# Altium project Power_meter.PrjPCB
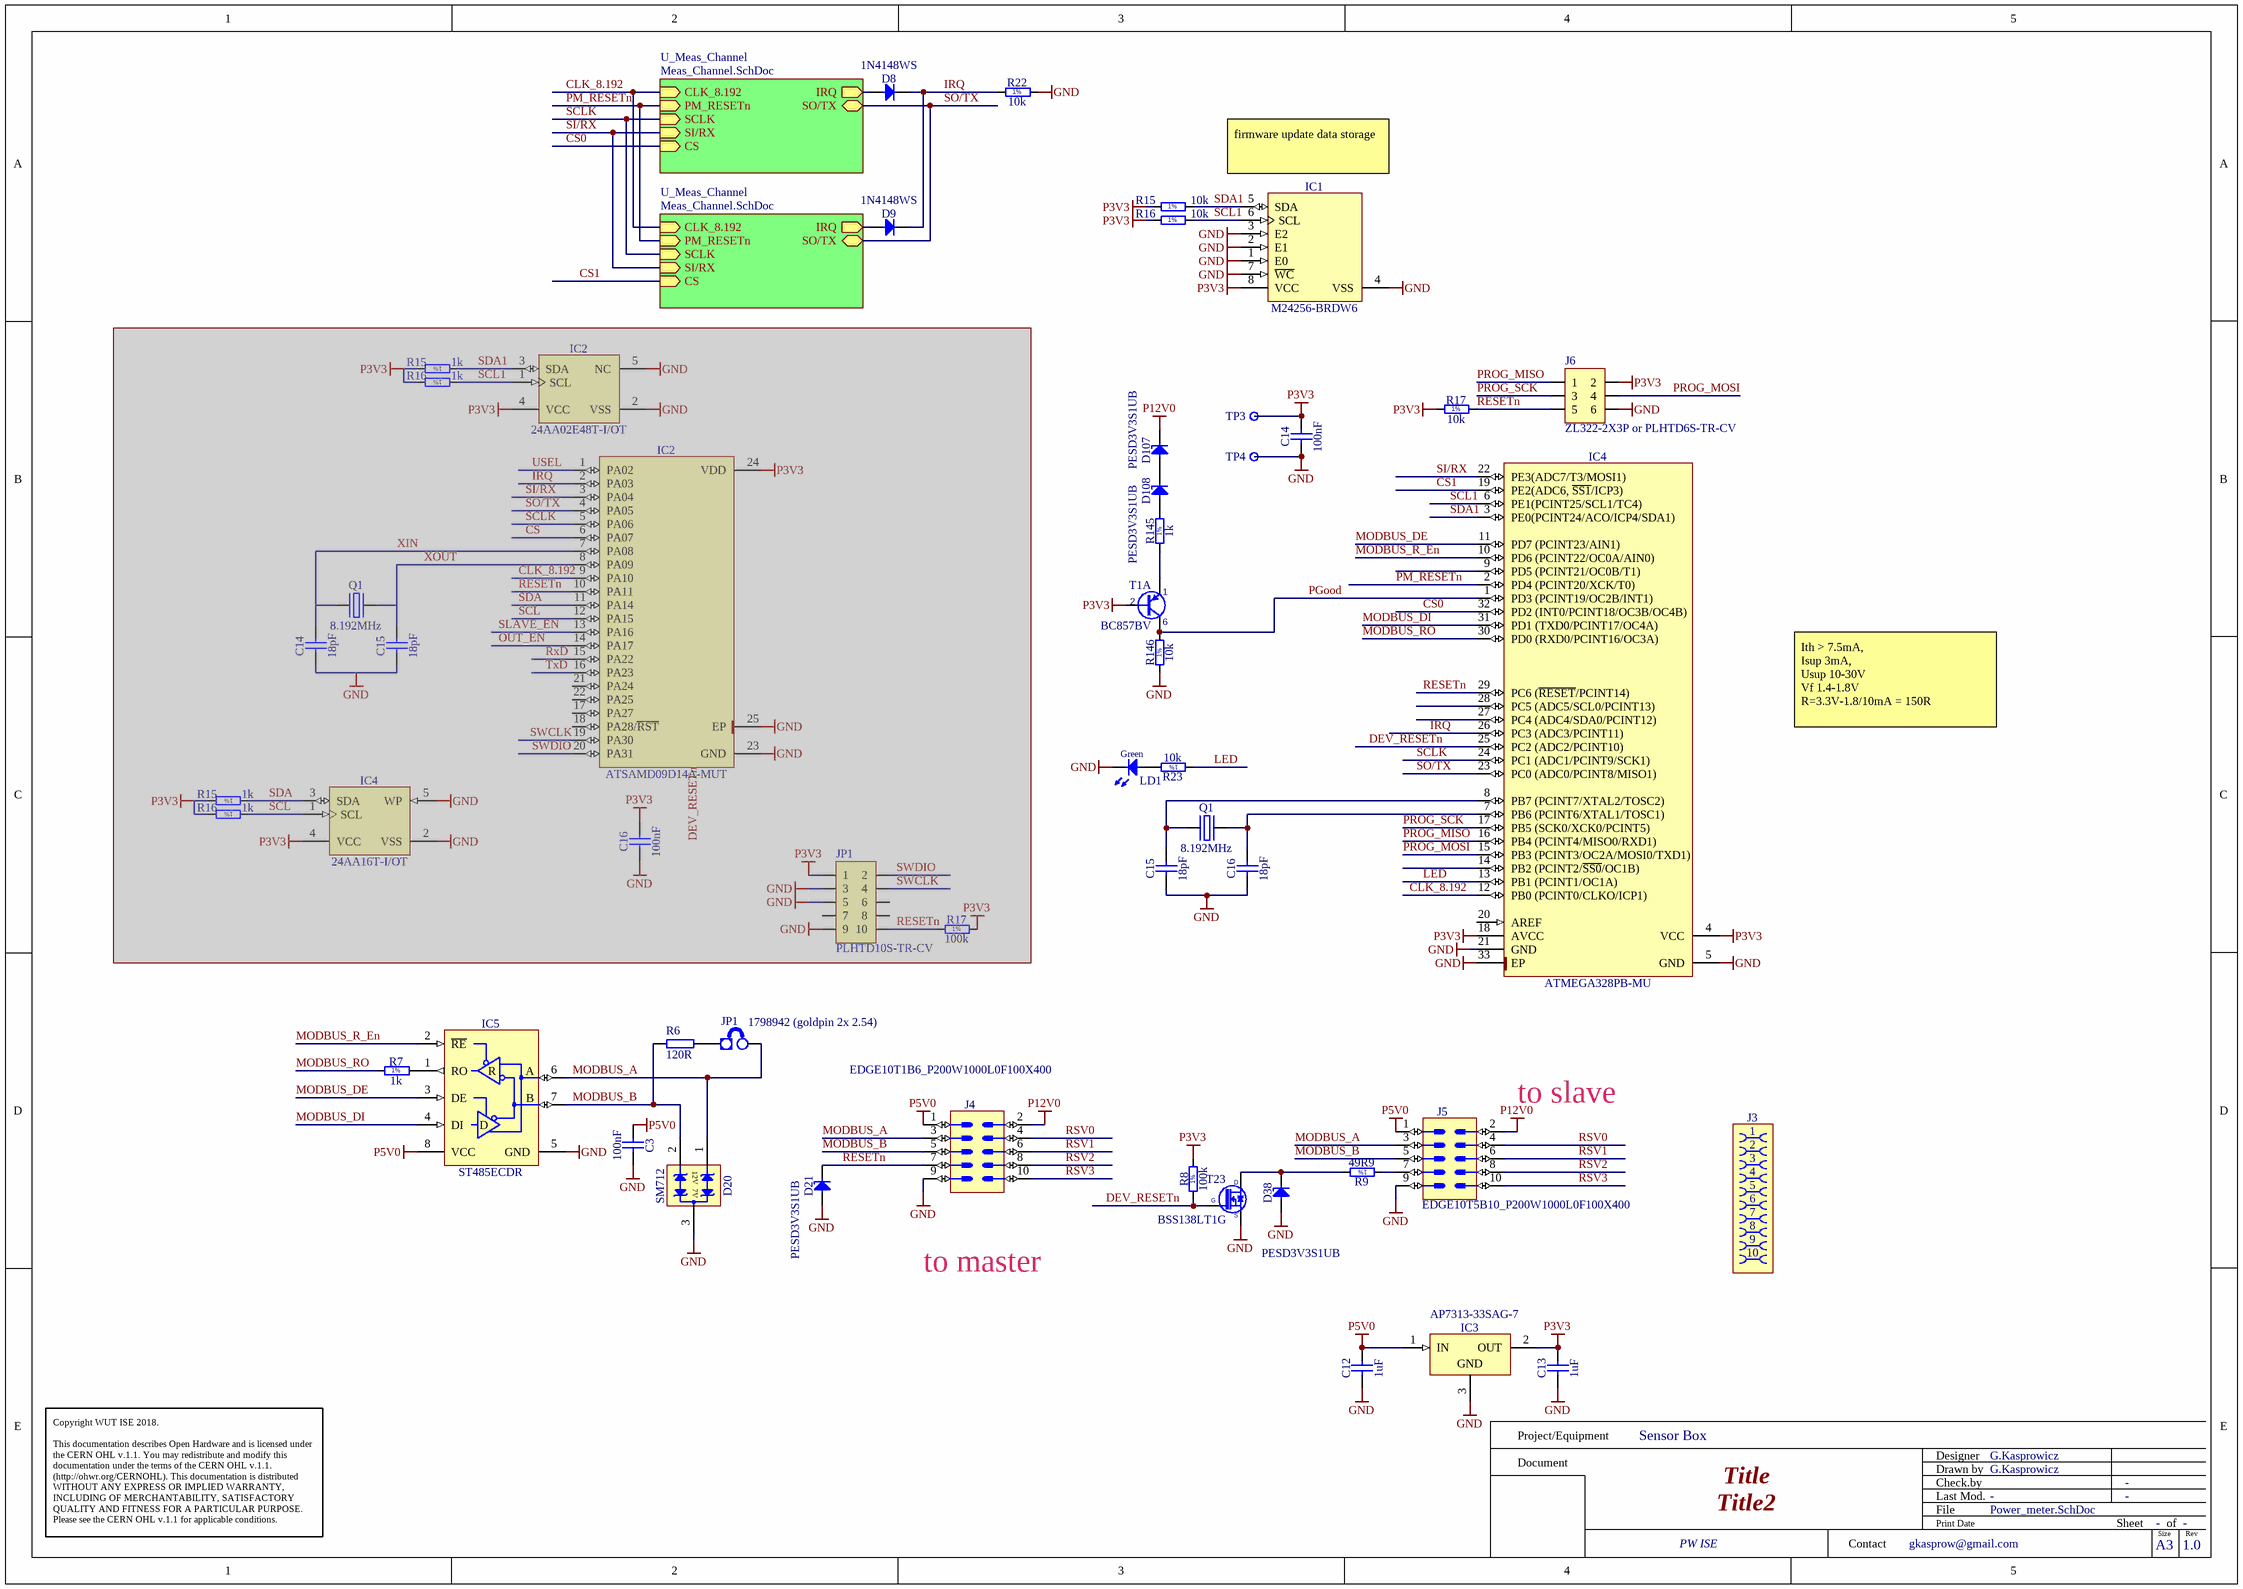
[diagram p0: Power_meter.SchDoc]
2 sheets, 114 parts. Net scope: hierarchical (ports join the sheet entries above them; power ports are global).
Board file: Power_meter.PCBDOC
Sheets:
  Power_meter.SchDoc
    U_Meas_Channel = Meas_Channel.SchDoc
    U_Meas_Channel = Meas_Channel.SchDoc

## Sheet Power_meter.SchDoc: Title
size 420 x 297 mm; Author: G.Kasprowicz; CompanyName: WUT ISE; DrawnBy: G.Kasprowicz; Organization: WUT ISE; Address1: PW ISE; Address2: Nowowiejska 15/19 00-665 Warsaw; Address3: gkasprow@gmail.com; Revision: 1.0; SheetNumber: -; SheetTotal: -; ModifiedBy: -; CheckedDate: -; Title2: Title2; DivGrp: WUT ISE; Designer: G.Kasprowicz; ModifiedDate: -; ProjectName: Sensor Box

### Parts
(Parts that share a designator on the sheet are numbered #1, #2 ... from top to bottom, then left to right.)
C3  100nF  [CAPC1005X55N]
C12  1uF  [CAPC1005X55N]
C13  1uF  [CAPC1005X55N]
C14#1  100nF  [CAPC1005X55N]
C14#2  18pF  [CAPC1005X55N]  (masked out: inside a compile mask, not in the netlist)
C15#1  18pF  [CAPC1005X55N]  (masked out: inside a compile mask, not in the netlist)
C15#2  18pF  [CAPC1005X55N]
C16#1  100nF  [CAPC1005X55N]  (masked out: inside a compile mask, not in the netlist)
C16#2  18pF  [CAPC1005X55N]
D8  1N4148WS  [SODFL2512X100N]
D9  1N4148WS  [SODFL2512X100N]
D20  SM712  [SOT95P237X112-3N]
D21  PESD3V3S1UB  [SODFL1608X65N]
D38  PESD3V3S1UB  [SODFL1608X65N]
D107  PESD3V3S1UB  [SODFL1608X65N]
D108  PESD3V3S1UB  [SODFL1608X65N]
IC1  M24256-BRDW6  [SOP65P640X120-8N]
IC2#1  24AA02E48T-I/OT  [SOT95P280X145-5N]  (masked out: inside a compile mask, not in the netlist)
IC2#2  ATSAMD09D14A-MUT  [QFN50P400X400X90-25N-S275]  (masked out: inside a compile mask, not in the netlist)
IC3  AP7313-33SAG-7  [SOT95P240X130-3N]
IC4#1  ATMEGA328PB-MU  [QFN50P500X500X100-33N-S325]
IC4#2  24AA16T-I/OT  [SOT95P280X145-5N]  (masked out: inside a compile mask, not in the netlist)
IC5  ST485ECDR  [SOIC127P600X175-8N]
J3  (no value)  [AVX_00 9159 010 061 916]
J4  (no value)  [EDGE10T1B6_P200W1000L0F100X400]
J5  (no value)  [EDGE10T5B10_P200W1000L0F100X400]
J6  ZL322-2X3P or PLHTD6S-TR-CV  [ZL322-2X3P]
JP1#1  PLHTD10S-TR-CV  [PLHTD10S-TR-CV]  (masked out: inside a compile mask, not in the netlist)
JP1#2  1798942 (goldpin 2x 2.54)  [jump]
LD1  Green  [LED_KINGBRIGHT_KPH-1608CGCK]
Q1#1  8.192MHz  [XTAL_ABRACON_ABLS]  (masked out: inside a compile mask, not in the netlist)
Q1#2  8.192MHz  [XTAL_ABRACON_ABLS]
R6  120R  [1206R]
R7  1k  [RESC1005X40N]
R8  100k  [RESC1005X40N]
R9  49R9  [RESC1005X40N]
R15#1  10k  [RESC1005X40N]
R15#2  1k  [RESC1005X40N]  (masked out: inside a compile mask, not in the netlist)
R15#3  1k  [RESC1005X40N]  (masked out: inside a compile mask, not in the netlist)
R16#1  10k  [RESC1005X40N]
R16#2  1k  [RESC1005X40N]  (masked out: inside a compile mask, not in the netlist)
R16#3  1k  [RESC1005X40N]  (masked out: inside a compile mask, not in the netlist)
R17#1  10k  [RESC1005X40N]
R17#2  100k  [RESC1005X40N]  (masked out: inside a compile mask, not in the netlist)
R22  10k  [RESC1005X40N]
R23  10k  [RESC1005X40N]
R145  1k  [RESC1005X40N]
R146  10k  [RESC1005X40N]
T1  BC857BV  [SOTFL50P160X60-6N]  (part A of 2)
T23  BSS138LT1G  [SOT95P240X110-3N]
TP3  Test Point  [TPS127]  (value not drawn)
TP4  Test Point  [TPS127]  (value not drawn)

### Sub-sheets
U_Meas_Channel = Meas_Channel.SchDoc: CLK_8.192 (in), IRQ (out), PM_RESETn (in), SCLK (in), SI/RX (in), CS (in), SO/TX (bidir)
U_Meas_Channel = Meas_Channel.SchDoc: CLK_8.192 (in), IRQ (out), PM_RESETn (in), SCLK (in), SI/RX (in), CS (in), SO/TX (bidir)

### Nets
GND: C3.2 C12.1 C13.1 C14#1.1 C15#2.1 C16#2.1 D20.3(GND) D21.2(A) D38.2(A) IC1.1(E0) IC1.2(E1) IC1.3(E2) IC1.4(VSS) IC1.7(~{WC}) IC3.3(GND) IC4#1.5(GND) IC4#1.21(GND) IC4#1.33(EP) IC5.5(GND) J4.9 J5.9 J6.6 LD1.1(C) R22.2 R146.1 T23.2(S) TP4.1
P3V3: C13.2 C14#1.2 IC1.8(VCC) IC3.2(OUT) IC4#1.4(VCC) IC4#1.18(AVCC) J6.2 R8.2 R15#1.1 R16#1.1 R17#1.1 T1.2(B) TP3.1
P5V0: C3.1 C12.2 IC3.1(IN) IC5.8(VCC) J4.1 J5.1
P12V0: D107.1(C) J4.2 J5.2
CLK_8.192: IC4#1.12(PB0_(PCINT0/CLKO/ICP1)) ; sheet U_Meas_Channel/CLK_8.192, sheet U_Meas_Channel/CLK_8.192
CS0: IC4#1.32(PD2_(INT0/PCINT18/OC3B/OC4B)) ; sheet U_Meas_Channel/CS
CS1: IC4#1.19(PE2(ADC6,_~{SS1}/ICP3)) ; sheet U_Meas_Channel/CS
DEV_RESETn: IC4#1.25(PC2_(ADC2/PCINT10)) R8.1 T23.1(G)
IRQ: D8.1(C) D9.1(C) IC4#1.26(PC3_(ADC3/PCINT11)) R22.1
LED: IC4#1.13(PB1_(PCINT1/OC1A)) R23.1
MODBUS_A: D20.1(I/O1) IC5.6(A) J4.3 J5.3 JP1#2.2(E2)
MODBUS_B: D20.2(I/O2) IC5.7(B) J4.5 J5.5 R6.1
MODBUS_DE: IC4#1.11(PD7_(PCINT23/AIN1)) IC5.3(DE)
MODBUS_DI: IC4#1.31(PD1_(TXD0/PCINT17/OC4A)) IC5.4(DI)
MODBUS_R_En: IC4#1.10(PD6_(PCINT22/OC0A/AIN0)) IC5.2(~{RE})
MODBUS_RO: IC4#1.30(PD0_(RXD0/PCINT16/OC3A)) R7.1
PGood: IC4#1.1(PD3_(PCINT19/OC2B/INT1)) R146.2 T1.6(C)
PM_RESETn: IC4#1.2(PD4_(PCINT20/XCK/T0)) ; sheet U_Meas_Channel/PM_RESETn, sheet U_Meas_Channel/PM_RESETn
PROG_MISO: IC4#1.16(PB4_(PCINT4/MISO0/RXD1)) J6.1
PROG_MOSI: IC4#1.15(PB3_(PCINT3/OC2A/MOSI0/TXD1)) J6.4
PROG_SCK: IC4#1.17(PB5_(SCK0/XCK0/PCINT5)) J6.3
RESETn: D21.1(C) IC4#1.29(PC6_(~{RESET}/PCINT14)) J4.7 J6.5 R17#1.2
RSV0: J4.4 J5.4
RSV1: J4.6 J5.6
RSV2: J4.8 J5.8
RSV3: J4.10 J5.10
SCL1: IC1.6(SCL) IC4#1.6(PE1(PCINT25/SCL1/TC4)) R16#1.2
SCLK: IC4#1.24(PC1_(ADC1/PCINT9/SCK1)) ; sheet U_Meas_Channel/SCLK, sheet U_Meas_Channel/SCLK
SDA1: IC1.5(SDA) IC4#1.3(PE0(PCINT24/ACO/ICP4/SDA1)) R15#1.2
SI/RX: IC4#1.22(PE3(ADC7/T3/MOSI1)) ; sheet U_Meas_Channel/SI/RX, sheet U_Meas_Channel/SI/RX
SO/TX: IC4#1.23(PC0_(ADC0/PCINT8/MISO1)) ; sheet U_Meas_Channel/SO/TX, sheet U_Meas_Channel/SO/TX
NetC15#2_2: C15#2.2 IC4#1.8(PB7_(PCINT7/XTAL2/TOSC2)) Q1#2.1(OSC1)
NetC16#2_2: C16#2.2 IC4#1.7(PB6_(PCINT6/XTAL1/TOSC1)) Q1#2.2(OSC2)
NetD8_2: D8.2(A) ; sheet U_Meas_Channel/IRQ
NetD9_2: D9.2(A) ; sheet U_Meas_Channel/IRQ
NetD38_1: D38.1(C) R9.2 T23.3(D)
NetD107_2: D107.2(A) D108.1(C)
NetD108_2: D108.2(A) R145.2
NetIC5_1: IC5.1(RO) R7.2
NetJ5_7: J5.7 R9.1
NetJP1#2_1: JP1#2.1(E1) R6.2
NetLD1_2: LD1.2(A) R23.2
NetR145_1: R145.1 T1.1(E)

Not connected (* = marked no-connect by the designer): IC4#1 9(PD5_(PCINT21/OC0B/T1)) 14(PB2_(PCINT2/~{SS0}/OC1B)) 20(AREF) 27(PC4_(ADC4/SDA0/PCINT12)) 28(PC5_(ADC5/SCL0/PCINT13))

### Notes on the sheet
- firmware update data storage
- Ith > 7.5mA,
  Isup 3mA,
  Usup 10-30V
  Vf 1.4-1.8V
  R=3.3V-1.8/10mA = 150R
- (near J5) to slave
- to master
- Project/Equipment
- Document
- Designer
- Drawn by
- Check.by
- Copyright WUT ISE 2018.
  This documentation describes Open Hardware and is licensed under the CERN OHL v.1.1. You may redistribute and modify this documentation under the terms of the CERN OHL v.1.1. (http://ohwr.org/CERNOHL). This documentation is distributed WITHOUT ANY EXPRESS OR IMPLIED WARRANTY, INCLUDING OF MERCHANTABILITY, SATISFACTORY QUALITY AND FITNESS FOR A PARTICULAR PURPOSE. Please see the CERN OHL v.1.1 for applicable conditions.
- Contact
- File
- Last Mod.
- Print Date
- Sheet
- Size
- A3
- of
- Rev
- (in symbol R0402_1K_1%_0.0625W_100PPM) 1%
- (in symbol R0402_10K_1%_0.0625W_100PPM) 1%
- (in symbol R0402_49R9_1%_0.0625W_100PPM) 1%
- (in symbol R0402_100K_1%_0.0625W_100PPM) 1%
- (in symbol SM712) 12V; 7V
- (in symbol ST485ECDR) R; D

### Library data of the parts
C3 = CC0402_100NF_16V_10%_X7R: Non-polarised capacitor; Part Description: SMD Multilayer Chip Ceramic Capacitor; Manufacturer: GENERIC; Manufacturer1 Part Number: GRM155R71C104KA88D; Voltage: 16V; TC: X7R; Tolerance: ±10%; Part Number: CC0402_100NF_16V_10%_X7R; Component Kind: Standard; Component Type: Standard; Pin Count: 2; Value: 100nF; Status: Not Recommended; Manufacturer Part Number: CC0402_100NF_16V_10%_X7R; Case: 0402; Mounted: Yes; Socket: No; SMD: Yes; Manufacturer1 Example: MURATA; Manufacturer1 ComponentHeight: 0.55mm; HelpURL: \\cern.ch\dfs\Applications\Altium\Datasheets\CC0402_X7R_MURATA_GRM.pdf; Author: CERN DEM JLC; CreateDate: 05.12.2013; LatestRevisionDate: 03.12.2007; Sense: No
C12 C13 = CC0402_1UF_16V_10%_X5R: Non-polarised capacitor; Part Description: SMD Multilayer Chip Ceramic Capacitor; Manufacturer: GENERIC; Manufacturer1 Part Number: C1005X5R1C105KT; Voltage: 16V; TC: X5R; Tolerance: ±10%; Part Number: CC0402_1UF_16V_10%_X5R; Component Kind: Standard; Component Type: Standard; Pin Count: 2; Value: 1uF; Status: Preferred; Manufacturer Part Number: CC0402_1UF_16V_10%_X5R; Case: 0402; Mounted: Yes; Socket: No; SMD: Yes; Sense: No; Manufacturer1 Example: TDK; Manufacturer1 ComponentHeight: 0.55mm; HelpURL: \\cern.ch\dfs\Applications\Altium\Datasheets\CC0402_X5R_TDK_C.pdf; Author: CERN DEM JLC; CreateDate: 25.10.2012; LatestRevisionDate: 25.10.2012
C14#1 C16#1 = CC0402_100NF_16V_10%_X5R: Non-polarised capacitor; Part Description: SMD Multilayer Chip Ceramic Capacitor; Manufacturer: GENERIC; Manufacturer1 Part Number: GRM155R61C104KA88D; Voltage: 16V; TC: X5R; Tolerance: ±10%; Part Number: CC0402_100NF_16V_10%_X5R; Component Kind: Standard; Component Type: Standard; Pin Count: 2; Value: 100nF; Status: None; Manufacturer Part Number: CC0402_100NF_16V_10%_X5R; Case: 0402; Mounted: Yes; Socket: No; SMD: Yes; Sense: No; Manufacturer1 Example: MURATA; Manufacturer1 ComponentHeight: 0.55mm; HelpURL: \\cern.ch\dfs\Applications\Altium\Datasheets\CC0402_X5R_MURATA_GRM.pdf; Author: CERN DEM JLC; CreateDate: 10.12.2013; LatestRevisionDate: 10.12.2013
C14#2 C15#1 C15#2 C16#2 = CC0402_18PF_50V_5%_C0G: Non-polarised capacitor; Part Description: SMD Multilayer Chip Ceramic Capacitor; Manufacturer: GENERIC; Manufacturer1 Part Number: C0402C180J5GACTU; Voltage: 50V; TC: C0G/NP0; Tolerance: ±5%; Part Number: CC0402_18PF_50V_5%_C0G; Component Kind: Standard; Component Type: Standard; Pin Count: 2; Value: 18pF; Status: Preferred; Manufacturer Part Number: CC0402_18PF_50V_5%_C0G; Case: 0402; Mounted: Yes; Socket: No; SMD: Yes; Sense: No; Manufacturer1 Example: KEMET; Manufacturer1 ComponentHeight: 0.55mm; HelpURL: \\cern.ch\dfs\Applications\Altium\Datasheets\CC0805_C0G_KEMET_(Commercial Grade).pdf; Author: CERN DEM JLC; CreateDate: 04.10.2016; LatestRevisionDate: 04.10.2016
D8 D9 = 1N4148WS: Diode; Part Description: Small Signal Diodes; Manufacturer: FAIRCHILD SEMICONDUCTOR; Voltage: 75V; Power: 150mA; PressFit: No; Bonding: No; Part Number: 1N4148WS; Component Kind: Standard; Component Type: Standard; Device: 1N4148WS; PackageDescription: SODFL Diode; 1.70mm W X 1.25mm L X 1.00mm H body, IPC Medium Density; Manufacturer Part Number: 1N4148WS; Pin Count: 2; Case: SOD-323F; Mounted: Yes; Socket: No; SMD: Yes; Sense: No; ComponentHeight: 1mm; HelpURL: \\cern.ch\dfs\Applications\Altium\Datasheets\1N4148WS.pdf; Author: CERN DEM JLC; CreateDate: 12.05.2011; LatestRevisionDate: 12.05.2011
D20 = SM712: Asymmetrical TVS Diode for Extended Common-Mode RS-485; Manufacturer: SEMTECH; Voltage: 12V/-7V; Power: 400W; PressFit: No; Bonding: No; Part Number: SM712; Component Kind: Standard; Component Type: Standard; Device: SM712; PackageDescription: SOT, 0.95mm, pitch; 3 pin,1.30mm W X 2.92mm L X 1.12mm H body, IPC Medium Density; Status: Obsolete; Part Description: Asymmetrical TVS Diode for Extended Common-Mode RS-485; Manufacturer Part Number: SM712; Pin Count: 3; Case: SOT-23; Mounted: Yes; Socket: No; SMD: Yes; Sense: No; ComponentHeight: 1.12mm; HelpURL: \\cern.ch\dfs\Applications\Altium\Datasheets\SM712.pdf; Author: CERN DEM JLC; CreateDate: 23.04.2012; LatestRevisionDate: 23.04.2012
D21 D38 D107 D108 = PESD3V3S1UB: ESD protection diode; Part Description: ESD protection diode (23kV); Manufacturer: NXP SEMICONDUCTORS; Voltage: 3V3; Power: 330W; PressFit: No; Bonding: No; Part Number: PESD3V3S1UB; Component Kind: Standard; Component Type: Standard; Device: PESD3V3S1UB; PackageDescription: Ultra Small Outline Diode Flat Lead (SOD-523), Body; 1.2mm L X 0.8mm W X 0.65mm H, IPC Medium Density; Manufacturer Part Number: PESD3V3S1UB; Pin Count: 2; Case: SOD523; Mounted: Yes; Socket: No; SMD: Yes; Sense: No; ComponentHeight: 0.65mm; HelpURL: \\cern.ch\dfs\Applications\Altium\Datasheets\PESD3V3S1UB.pdf; Author: CERN DEM JLC; CreateDate: 29.11.2012; LatestRevisionDate: 29.11.2012
IC1 = MEM_M24256-BRDW6P: 256-Kbit Serial I²C Bus EEPROM; Manufacturer: ST MICROELECTRONICS; PressFit: No; Bonding: No; Part Number: M24256-BRDW6P; Component Kind: Standard; Component Type: Standard; Device: M24256-BRDW6; PackageDescription: SOP, 0.65mm pitch; 8 pin, 4.40mm W X 3.00mm L X 1.20mm H body, IPC Medium Density; Part Description: 256-Kbit Serial I²C Bus EEPROM; Manufacturer Part Number: M24256-BRDW6; Pin Count: 8; Case: TSSOP8; Mounted: Yes; Socket: No; SMD: Yes; Sense: No; ComponentHeight: 1.2mm; HelpURL: \\cern.ch\dfs\Applications\Altium\Datasheets\M24256-BRDW6P.pdf; Author: CERN DEM MR; CreateDate: 17.03.2016; LatestRevisionDate: 17.03.2016
IC2#1 = 24AA02E48T-I/OT: 1.7V-5.5V, 2K I2C Serial EEPROM With EUI-48 Node Identity; Manufacturer: MICROCHIP TECHNOLOGY; PressFit: No; Bonding: No; Part Number: 24AA02E48T-I/OT; Component Kind: Standard; Component Type: Standard; Device: 24AA02E48T-I/OT; PackageDescription: SOT, 0.95mm pitch; 5 pin, 1.60mm W X 2.90mm L X 1.45mm H body, IPC Medium Density; Part Description: 1.7V-5.5V, 2K I2C Serial EEPROM With EUI-48 Node Identity; Manufacturer Part Number: 24AA02E48T-I/OT; Pin Count: 5; Case: SOT23-5; Mounted: Yes; Socket: No; SMD: Yes; Sense: No; ComponentHeight: 1.45mm; HelpURL: \\cern.ch\dfs\Applications\Altium\Datasheets\24AA02E48T-I-OT.pdf; Author: CERN DEM MR; CreateDate: 31.03.2016; LatestRevisionDate: 31.03.2016
IC2#2 = ATSAMD09D14A-MUT: 32-bit ARM®-based Cortex®-M0+ core Microcontroller, 2.4V to 3.63V, 48MHz, 16KB Flash, 4 KB SRAM, 24 QFN, Temperature Range -40°C to 85°C; Manufacturer: MICROCHIP; PressFit: No; Bonding: No; Part Number: ATSAMD09D14A-MUT; Component Kind: Standard; Component Type: Standard; Device: ATSAMD09D14A-MUT; PackageDescription: QFN, 0.50mm Pitch, Square; 24 Pin, 4.00mm L X 4.00mm W X 0.90mm H Body (w/Thermal Tab 2.75 X 2.75 mm), IPC Medium Density; Part Description: 32-bit ARM®-based Cortex®-M0+ core Microcontroller, 2.4V to 3.63V, 48MHz, 16KB Flash, 4 KB SRAM, 24 QFN, Temperature Range -40°C to 85°C; Manufacturer Part Number: ATSAMD09D14A-MUT; Pin Count: 25; Case: QFN24; Mounted: Yes; Socket: No; SMD: Yes; Sense: No; ComponentHeight: 0.9mm; HelpURL: \\cern.ch\dfs\Applications\Altium\Datasheets\ATSAMD09D14A-MUT.pdf; Author: CERN DEM MR; CreateDate: 13.02.2018; LatestRevisionDate: 13.02.2018
IC3 = AP7313-33SAG-7: 3-Terminal Regulator 1=IN 2=OUT 3=GND; Part Description: 3.3V, 150mA Low Quiescent Current, Fast Transient Low Dropout Linear Regulator; Manufacturer: DIODES INCORPORATED; PressFit: No; Bonding: No; Part Number: AP7313-33SAG-7; Component Kind: Standard; Component Type: Standard; Device: AP7313-33SAG-7; PackageDescription: SOT23 3-Leads, Pitch 0.95mm - Body 1.3x2.9mm, IPC Medium Density; Manufacturer Part Number: AP7313-33SAG-7; Pin Count: 3; Case: SOT23; Mounted: Yes; Socket: No; SMD: Yes; Sense: No; ComponentHeight: 1.35mm; HelpURL: \\cern.ch\dfs\Applications\Altium\Datasheets\AP7313-33SAG-7.pdf; Author: CERN DEM JLC; CreateDate: 20.03.2018; LatestRevisionDate: 20.03.2018
IC4#1 = UPC_ATMEGA328PB-MU: 8-bit AVR 20MHz Microcontroller With 32K Bytes In-System  Programmable  Flash; Part Description: 8-bit AVR Microcontroller, 32KB Flash, 1KB EEPROM, 2KB SRAM, 32-pin MLF, Industrial Grade (-40°C to 85°C); Manufacturer: ATMEL; PressFit: No; Bonding: No; Part Number: ATMEGA328PB-MU; Component Kind: Standard; Component Type: Standard; Device: ATMEGA328PB-MU; PackageDescription: QFN, (MO-220-VHHD-2) 0.50mm pitch,square; 8 pin X 8 pin, 5mm X 5mm X 1.00mm H body (w/thermal tab 3.25 X 3.25mm),  IPC Medium Density; Manufacturer Part Number: ATMEGA328PB-MU; Pin Count: 33; Case: QFN32; Mounted: Yes; Socket: No; SMD: Yes; Sense: No; ComponentHeight: 1mm; HelpURL: \\cern.ch\dfs\Applications\Altium\Datasheets\ATMEGA328P-MU.pdf; Author: GK; CreateDate: 2011-02-08; LatestRevisionDate: 2014-07-02
IC4#2 = MEM_24AA16T_SOT23: 1.7V-5.5V, 2K I2C Serial EEPROM With EUI-48 Node Identity; Part Description: 1.7V-5.5V, 16K I2C Serial EEPROM; Manufacturer: MICROCHIP TECHNOLOGY; PressFit: No; Bonding: No; Part Number: 24AA16T-I/OT; Component Kind: Standard; Component Type: Standard; Device: 24AA16T-I/OT; PackageDescription: SOT, 0.95mm pitch; 5 pin, 1.60mm W X 2.90mm L X 1.45mm H body, IPC Medium Density; Manufacturer Part Number: 24AA16T-I/OT; Pin Count: 5; Case: SOT23-5; Mounted: Yes; Socket: No; SMD: Yes; Sense: No; ComponentHeight: 1.45mm; HelpURL: \\cern.ch\dfs\Applications\Altium\Datasheets\24AA02E48T-I-OT.pdf; Author: GK; CreateDate: 31.03.2016; LatestRevisionDate: 31.03.2016
IC5 = ST485ECDR: ±15kV ESD-Protected, Low Power  RS-485/RS-422 Transceiver; Manufacturer: ST MICROELECTRONICS; PressFit: No; Bonding: No; Part Number: ST485ECDR; Component Kind: Standard; Component Type: Standard; Device: ST485ECDR; PackageDescription: SOIC 8, Pitch 1.27mm - Body 4x5mm, IPC Medium Density; Part Description: ±15kV ESD-Protected, Low Power  RS-485/RS-422 Transceiver; Manufacturer Part Number: ST485ECDR; Pin Count: 8; Case: SOIC8; Mounted: Yes; Socket: No; SMD: Yes; Sense: No; ComponentHeight: 1.75mm; Author: CERN DEM MR; HelpURL: \\cern.ch\dfs\Applications\Altium\Datasheets\ST485ECDR.pdf; CreateDate: 15.02.2018; LatestRevisionDate: 15.02.2018
J3 = AVX_00 9159 010 061 916: Open Ended Card Edge Connector, 9159 Series; Part Description: 10 Contacts, 2mm Pitch, Open Ended Card Edge Connector, 9159 Series; Manufacturer: AVX; PressFit: No; Part Number: AVX_00 9159 010 061 916; Component Kind: Standard; Component Type: Standard; Pin Count: 10; Mounted: Yes; Socket: No; SMD: No; Sense: No; Status: None; Manufacturer Part Number: 00 9159 010 061 916; ComponentHeight: 1.6mm; HelpURL: \\cern.ch\dfs\Applications\Altium\Datasheets\AVX_00 9159 010 061 916.pdf; Author: CERN DEM MR; CreateDate: 13.02.2018; LatestRevisionDate: 13.02.2018
J4 = EDGE10T1B6_P200W1000L0F100X400: PCB Edge Connector 10 (2x5); Part Description: 10 Contacts Board Edge Connector, Pitch 2mm, Length 0mm, Width 10mm, Finger Lenght 4mm, Finger Width 1mm; Mounted: No; PressFit: No; Part Number: EDGE10T1B6_P200W1000L0F100X400; Component Kind: Standard (No BOM); Component Type: Standard (No BOM); Pin Count: 10; Socket: No; SMD: No; Sense: No; Status: None; ComponentHeight: 0mm; HelpURL: \\cern.ch\dfs\Applications\Altium\Datasheets\EDGE10T1B6_P200W1000L0F100X400.pdf; Author: CERN DEM MR; CreateDate: 14.02.2018; LatestRevisionDate: 14.02.2018
J5 = EDGE10T5B10_P200W1000L0F100X400: PCB Edge Connector 10 (2x5); Part Description: 10 Contacts Board Edge Connector, Pitch 2mm, Length 0mm, Width 10mm, Finger Lenght 4mm, Finger Width 1mm; Mounted: No; PressFit: No; Part Number: EDGE10T5B10_P200W1000L0F100X400; Component Kind: Standard (No BOM); Component Type: Standard (No BOM); Pin Count: 10; Socket: No; SMD: No; Sense: No; Status: None; ComponentHeight: 0mm; HelpURL: \\cern.ch\dfs\Applications\Altium\Datasheets\EDGE10T5B10_P200W1000L0F100X400.pdf; Author: CERN DEM MR; CreateDate: 14.02.2018; LatestRevisionDate: 14.02.2018
J6 = CON_2x3 1.27 SMT Male: 1.27 mm dual row goldpin (Maritex)
JP1#1 = CON_2x5 1.27 SMT Male: 1.27 mm dual row goldpin (Maritex)
JP1#2 = JUMPER: Supplier 1: Farnell; Supplier Part Number 1: 1798942
LD1 = LED_KINGBRIGHT_KPH-1608CGCK: LED Green 1C 2A; Part Description: SMD Green LED, Case 1.6mmX0.8mm(0603), 0.65mm Thickness; PressFit: No; Bonding: No; Part Number: LED_KINGBRIGHT_KPH-1608CGCK; Component Kind: Standard; Component Type: Standard; Color: Green; PackageDescription: SMT Green LED, Case 0603, Body L 1.6 x W 0.8mm H 0.65mm; Manufacturer: KINGBRIGHT; Manufacturer Part Number: KPH-1608CGCK; Pin Count: 2; Mounted: Yes; Socket: No; SMD: Yes; Sense: No; ComponentHeight: 0.65mm; HelpURL: \\cern.ch\dfs\Applications\Altium\Datasheets\LED_KINGBRIGHT_KPH-1608CGCK.pdf; Author: CERN DEM JLC; CreateDate: 03.07.2017; LatestRevisionDate: 03.07.2017
Q1#1 Q1#2 = XTAL_8.192MHZ_ABRACON_ABLS-8.192MHZ-B2-T: Quartz Crystal; Part Description: Tolerance: ± 20ppm, Stability: ± 50ppm, -20°C to +70°C, 18pF, 80 Ohms ESR, Low Profile Surface Mount Microprocessor Crystal, ABLS Series; PressFit: No; Bonding: No; Part Number: XTAL_8.192MHZ_ABRACON_ABLS-8.192MHZ-B2-T; Component Kind: Standard; Component Type: Standard; PackageDescription: SMD Crystal, Body 11.40mm L X 4.70mm W X 4.20mm H, HC/49US (AT49) ALBS Series; Value: 8.192MHz; Manufacturer: ABRACON; Manufacturer Part Number: ABLS-8.192MHZ-B2-T; Pin Count: 2; Mounted: Yes; Socket: No; SMD: Yes; Sense: No; ComponentHeight: 4.2mm; HelpURL: \\cern.ch\dfs\Applications\Altium\Datasheets\XTAL_ABRACON_ABLS.pdf; Author: CERN DEM MR; CreateDate: 15.02.2018; LatestRevisionDate: 15.02.2018
R6 = RES_1206: SMD Resistor; Supplier 1: Newark; Supplier Part Number 1: 39K0871
R7 R15#2 R15#3 R16#2 R16#3 R145 = R0402_1K_1%_0.0625W_100PPM: Resistor - 1%; Part Description: General Purpose Thick Film Chip Resistor; Manufacturer: GENERIC; Manufacturer1 Part Number: 232270671002L; TC: ±100ppm/°C; PressFit: No; Part Number: R0402_1K_1%_0.0625W_100PPM; Component Kind: Standard; Component Type: Standard; Pin Count: 2; Value: 1k; Status: Not Recommended; Power: 0.0625W; Tolerance: ±1%; Manufacturer Part Number: R0402_1K_1%_0.0625W_100PPM; Case: 0402; Mounted: Yes; Sense: No; Socket: No; SMD: Yes; Manufacturer1 Example: YAGEO PHYCOMP; Manufacturer1 ComponentHeight: 0.4mm; HelpURL: \\cern.ch\dfs\Applications\Altium\Datasheets\R0402_Phycomp_RC0402.pdf; Author: CERN DEM JLC; CreateDate: 03.12.2007; LatestRevisionDate: 17.10.2012
R8 R17#2 = R0402_100K_1%_0.0625W_100PPM: Resistor - 1%; Part Description: General Purpose Thick Film Chip Resistor; Manufacturer: GENERIC; Manufacturer1 Part Number: 232270671004L; TC: ±100ppm/°C; PressFit: No; Part Number: R0402_100K_1%_0.0625W_100PPM; Component Kind: Standard; Component Type: Standard; Pin Count: 2; Value: 100k; Status: Not Recommended; Power: 0.0625W; Tolerance: ±1%; Manufacturer Part Number: R0402_100K_1%_0.0625W_100PPM; Case: 0402; Mounted: Yes; Sense: No; Socket: No; SMD: Yes; Manufacturer1 Example: YAGEO PHYCOMP; Manufacturer1 ComponentHeight: 0.4mm; HelpURL: \\cern.ch\dfs\Applications\Altium\Datasheets\R0402_Phycomp_RC0402.pdf; Author: CERN DEM JLC; CreateDate: 03.12.2007; LatestRevisionDate: 17.10.2012
R9 = R0402_49R9_1%_0.0625W_100PPM: Resistor - 1%; Part Description: General Purpose Thick Film Chip Resistor; Manufacturer: GENERIC; Manufacturer1 Part Number: 232270674999L or RC0402FR-0749R9L; TC: ±100ppm/°C; Table: Resistors SMD; Part Number: R0402_49R9_1%_0.0625W_100PPM; Component Kind: Standard; Component Type: Standard; Pin Count: 2; Value: 49R9; Status: Not recommended; Power: 0.0625W; Tolerance: ±1%; Manufacturer Part Number: R0402_49R9_1%_0.0625W_100PPM; Case: 0402; Mounted: Yes; Socket: No; SMD: Yes; Manufacturer1 Example: YAGEO PHYCOMP; Manufacturer1 ComponentHeight: 0.4mm; HelpURL: \\cern.ch\dfs\Applications\Altium\Datasheets\R0402_Phycomp_RC0402.pdf; Author: CERN DEM JLC; CreateDate: 2012-10-24; LatestRevisionDate: 2012-10-24
R15#1 R16#1 R17#1 R22 R23 R146 = R0402_10K_1%_0.0625W_100PPM: Resistor - 1%; Part Description: General Purpose Thick Film Chip Resistor; Manufacturer: GENERIC; Manufacturer1 Part Number: 232270671003L; TC: ±100ppm/°C; PressFit: No; Part Number: R0402_10K_1%_0.0625W_100PPM; Component Kind: Standard; Component Type: Standard; Pin Count: 2; Value: 10k; Status: Not Recommended; Power: 0.0625W; Tolerance: ±1%; Manufacturer Part Number: R0402_10K_1%_0.0625W_100PPM; Case: 0402; Mounted: Yes; Sense: No; Socket: No; SMD: Yes; Manufacturer1 Example: YAGEO PHYCOMP; Manufacturer1 ComponentHeight: 0.4mm; HelpURL: \\cern.ch\dfs\Applications\Altium\Datasheets\R0402_Phycomp_RC0402.pdf; Author: CERN DEM JLC; CreateDate: 03.12.2007; LatestRevisionDate: 17.10.2012
T1 = BC857BV: 45V, 100mA PNP General Purpose Double Transistor; Part Description: -45V -100mA PNP General Purpose Double Transistor; Manufacturer: NXP SEMICONDUCTORS; PressFit: No; Bonding: No; Part Number: BC857BV; Component Kind: Standard; Component Type: Standard; Device: BC857BV; PackageDescription: SOTFL (SOT666), 0.50mm, Pitch; 6 Pin, 1.20mm W X 1.60mm L X 0.60mm H Body, IPC Medium Density; Manufacturer Part Number: BC857BV; Pin Count: 6; Case: SOT666; Mounted: Yes; Socket: No; SMD: Yes; Sense: No; ComponentHeight: 0.6mm; HelpURL: \\cern.ch\dfs\Applications\Altium\Datasheets\BC857BV.pdf; Author: CERN DEM JLC; CreateDate: 01.12.2011; LatestRevisionDate: 01.12.2011
T23 = BSS138LT1G: N-CHANNEL MOSFET WITH DIODE; Part Description: 50V 200mA N-Channel Enhancement Mode Field-Effect Transistor; Manufacturer: ON SEMICONDUCTOR; PressFit: No; Bonding: No; Part Number: BSS138LT1G; Component Kind: Standard; Component Type: Standard; Device: BSS138LT1G; PackageDescription: SOT23 3-Leads, Pitch 0.95mm - Body 1.4x3mm, IPC Medium Density; Manufacturer Part Number: BSS138LT1G; Pin Count: 3; Case: SOT23-3; Mounted: Yes; Socket: No; SMD: Yes; Sense: No; ComponentHeight: 1.11mm; HelpURL: \\cern.ch\dfs\Applications\Altium\Datasheets\BSS138LT1G.pdf; Author: CERN DEM JLC; CreateDate: 23.03.2009; LatestRevisionDate: 23.03.2009
TP3 TP4 = SMD_PAD_1.27X1.27MM: Part Description: 1.27mm x 1.27mm PCB Copper Area (SMD Test Point); Mounted: No; Part Number: SMD_PAD_1.27X1.27MM; Component Kind: Standard (No BOM); Component Type: Standard (No BOM); Pin Count: 1; Family: Test Point; Socket: No; SMD: Yes; Sense: No; Status: None; ComponentHeight: 0mm; HelpURL: Undefined; Author: CERN DEM JLC; CreateDate: 12.01.2008; LatestRevisionDate: 12.01.2008; PackageDescription: 1.27mm x 1.27mm PCB Copper Area (SMD Test Point)

## Sheet Meas_Channel.SchDoc: Title
size 420 x 297 mm; Author: G.Kasprowicz; CompanyName: WUT ISE; DrawnBy: G.Kasprowicz; Organization: WUT ISE; Address1: PW ISE; Address2: Nowowiejska 15/19 00-665 Warsaw; Address3: gkasprow@gmail.com; Revision: 1.0; SheetNumber: -; SheetTotal: -; ModifiedBy: -; CheckedDate: -; Title2: Title2; DivGrp: WUT ISE; Designer: G.Kasprowicz; ModifiedDate: -; ProjectName: Sensor Box
Used 2 times, as channels U_Meas_Channel, U_Meas_Channel. Parts and nets are listed once, with the designators drawn on the sheet.
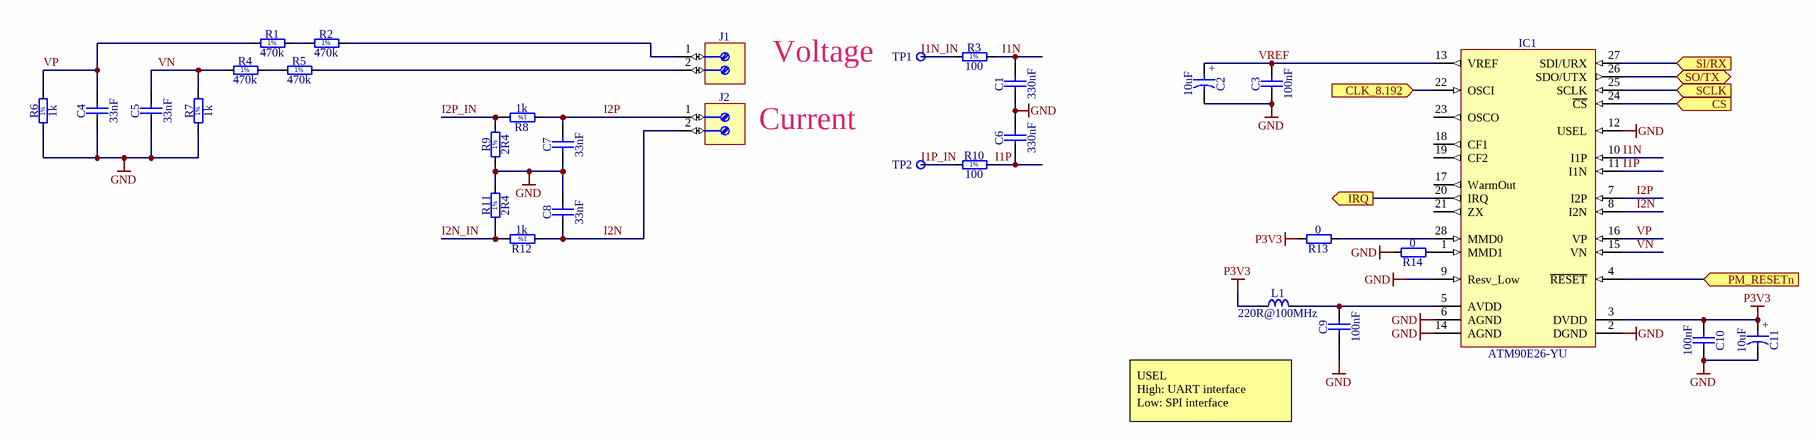
[diagram p1: Meas_Channel.SchDoc]

### Parts
C1  330nF  [CAPC1608X87N]
C2  10uF  [CAPMP3216X180N]
C3  100nF  [CAPC1005X55N]
C4  33nF  [CAPC1005X55N]
C5  33nF  [CAPC1005X55N]
C6  330nF  [CAPC1608X87N]
C7  33nF  [CAPC1005X55N]
C8  33nF  [CAPC1005X55N]
C9  100nF  [CAPC1005X55N]
C10  100nF  [CAPC1005X55N]
C11  10uF  [CAPMP3216X180N]
IC1  ATM90E26-YU  [SOP65P780X200-28N]
J1  (no value)  [PHOENIX_1751248]
J2  (no value)  [PHOENIX_1725656]
L1  220R@100MHz  [INDC1005X55N]
R1  470k  [RESC3216X65N]
R2  470k  [RESC3216X65N]
R3  100  [RESC1005X40N]
R4  470k  [RESC3216X65N]
R5  470k  [RESC3216X65N]
R6  1k  [RESC1005X40N]
R7  1k  [RESC1005X40N]
R8  1k  [RESC1005X40N]
R9  2R4  [RESC1608X55N]
R10  100  [RESC1005X40N]
R11  2R4  [RESC1608X55N]
R12  1k  [RESC1005X40N]
R13  0  [RESC1005X40N]
R14  0  [RESC1005X40N]
TP1  Test Point  [TPS127]  (value not drawn)
TP2  Test Point  [TPS127]  (value not drawn)

### Ports
CLK_8.192 (in), CS (in), IRQ (out), PM_RESETn (in), SCLK (in), SI/RX (in), SO/TX (bidir)

### Nets
GND: C1.1 C2.2 C3.1 C4.1 C5.1 C6.2 C7.1 C8.2 C9.1 C10.2 C11.2 IC1.2(DGND) IC1.6(AGND) IC1.9(Resv_Low) IC1.12(USEL) IC1.14(AGND) R6.1 R7.1 R9.1 R11.2 R14.2
P3V3: C10.1 C11.1 IC1.3(DVDD) L1.1 R13.2
CLK_8.192: IC1.22(OSCI) ; port CLK_8.192
CS: IC1.24(~{CS}) ; port CS
I1N: C1.2 IC1.10(I1P) R3.2
I1N_IN: R3.1 TP1.1
I1P: C6.1 IC1.11(I1N) R10.2
I1P_IN: R10.1 TP2.1
I2N: C8.1 IC1.8(I2N) J2.2 R12.1
I2N_IN: R11.1 R12.2
I2P: C7.2 IC1.7(I2P) J2.1 R8.1
I2P_IN: R8.2 R9.2
IRQ: IC1.20(IRQ) ; port IRQ
PM_RESETn: IC1.4(~{RESET}) ; port PM_RESETn
SCLK: IC1.25(SCLK) ; port SCLK
SI/RX: IC1.27(SDI/URX) ; port SI/RX
SO/TX: IC1.26(SDO/UTX) ; port SO/TX
VN: C5.2 IC1.15(VN) R4.1 R7.2
VP: C4.2 IC1.16(VP) R1.1 R6.2
VREF: C2.1 C3.2 IC1.13(VREF)
NetC9_2: C9.2 IC1.5(AVDD) L1.2
NetIC1_1: IC1.1(MMD1) R14.1
NetIC1_28: IC1.28(MMD0) R13.1
NetJ1_1: J1.1 R2.2
NetJ1_2: J1.2 R5.2
NetR1_2: R1.2 R2.1
NetR4_2: R4.2 R5.1

Not connected (* = marked no-connect by the designer): IC1 17(WarmOut) 18(CF1) 19(CF2) 21(ZX) 23(OSCO)

### Channels
U_Meas_Channel: designators end in B; ports CLK_8.192=CLK_8.192 CS=CS0 IRQ=NetD8_2 PM_RESETn=PM_RESETn SCLK=SCLK SI/RX=SI/RX SO/TX=SO/TX
U_Meas_Channel: designators end in A; ports CLK_8.192=CLK_8.192 CS=CS1 IRQ=NetD9_2 PM_RESETn=PM_RESETn SCLK=SCLK SI/RX=SI/RX SO/TX=SO/TX

### Notes on the sheet
- (near TP1) Voltage
- Current
- USEL
  High: UART interface
  Low: SPI interface
- Project/Equipment
- Document
- Designer
- Drawn by
- Check.by
- Copyright WUT ISE 2018.
  This documentation describes Open Hardware and is licensed under the CERN OHL v.1.1. You may redistribute and modify this documentation under the terms of the CERN OHL v.1.1. (http://ohwr.org/CERNOHL). This documentation is distributed WITHOUT ANY EXPRESS OR IMPLIED WARRANTY, INCLUDING OF MERCHANTABILITY, SATISFACTORY QUALITY AND FITNESS FOR A PARTICULAR PURPOSE. Please see the CERN OHL v.1.1 for applicable conditions.
- Contact
- File
- Last Mod.
- Print Date
- Sheet
- Size
- A3
- of
- Rev
- (in symbol CTE3216-18_10UF_16V_20%_AVX_TCJ) +
- (in symbol R0402_1K_1%_0.0625W_100PPM) 1%
- (in symbol R0402_100R_1%_0.0625W_100PPM) 1%
- (in symbol R0603_2R4_1%_0.1W_200PPM) 1%
- (in symbol R1206_470K_1%_0.25W_100PPM) 1%

### Library data of the parts
C1 C6 = CC0603_330NF_16V_10%_X5R: Non-polarised capacitor; Part Description: SMD Multilayer Chip Ceramic Capacitor; Manufacturer: GENERIC; Manufacturer1 Part Number: 223878613656; Voltage: 16V; TC: X5R; Tolerance: ±10%; Part Number: CC0603_330NF_16V_10%_X5R; Component Kind: Standard; Component Type: Standard; Pin Count: 2; Value: 330nF; Status: Preferred; Manufacturer Part Number: CC0603_330NF_16V_10%_X5R; Case: 0603; Mounted: Yes; Socket: No; SMD: Yes; Sense: No; Manufacturer1 Example: PHYCOMP; Manufacturer1 ComponentHeight: 0.87mm; HelpURL: \\cern.ch\dfs\Applications\Altium\Datasheets\CC0805_X5R_PHYCOMP_HC.pdf; Author: CERN DEM JLC; CreateDate: 03.12.2007; LatestRevisionDate: 03.12.2007
C2 C11 = CTE3216-18_10UF_16V_20%_AVX_TCJ: Polarised capacitor; Part Description: ESR 0R200 Tantalum Solid Electrolytic Chip Capacitor with Conductive Polymer Electrode; Manufacturer: AVX; Manufacturer Part Number: TCJA106M016R0200; Voltage: 16V; Tolerance: ±20%; Part Number: CTE3216-18_10UF_16V_20%_AVX_TCJ; Component Kind: Standard; Component Type: Standard; Pin Count: 2; Value: 10uF; Status: Preferred; Case: A; Mounted: Yes; Socket: No; SMD: Yes; Sense: No; ComponentHeight: 1.8mm; HelpURL: \\cern.ch\dfs\Applications\Altium\Datasheets\CTE_AVX_TCJ.pdf; Author: CERN DEM JLC; CreateDate: 29.03.2012; LatestRevisionDate: 29.03.2012
C3 C9 C10 = CC0402_100NF_16V_10%_X5R: as C14#1 on sheet Power_meter; Part Number: CC0402_100NF_16V_10%_X5R; Component Kind: Standard; Component Type: Standard; Pin Count: 2; Value: 100nF; Status: None; Manufacturer Part Number: CC0402_100NF_16V_10%_X5R; Case: 0402; Mounted: Yes; Socket: No; SMD: Yes; Sense: No; Manufacturer1 Example: MURATA; Manufacturer1 ComponentHeight: 0.55mm; HelpURL: \\cern.ch\dfs\Applications\Altium\Datasheets\CC0402_X5R_MURATA_GRM.pdf; Author: CERN DEM JLC; CreateDate: 10.12.2013; LatestRevisionDate: 10.12.2013
C4 C5 C7 C8 = CC0402_33NF_16V_10%_X7R: Non-polarised capacitor; Part Description: SMD Multilayer Chip Ceramic Capacitor; Manufacturer: GENERIC; Manufacturer1 Part Number: 223878715643; Voltage: 16V; TC: X7R; Tolerance: ±10%; Part Number: CC0402_33NF_16V_10%_X7R; Component Kind: Standard; Component Type: Standard; Pin Count: 2; Value: 33nF; Status: Not Recommended; Manufacturer Part Number: CC0402_33NF_16V_10%_X7R; Case: 0402; Mounted: Yes; Socket: No; SMD: Yes; Sense: No; Manufacturer1 Example: PHYCOMP; Manufacturer1 ComponentHeight: 0.55mm; HelpURL: \\cern.ch\dfs\Applications\Altium\Datasheets\CC0402_X7R_PHYCOMP.pdf; Author: CERN DEM JLC; CreateDate: 03.12.2007; LatestRevisionDate: 03.12.2007
IC1 = ATM90E26-YU: Single-Phase High-Performance Wide-Span, Energy Metering IC; Manufacturer: MICROCHIP TECHNOLOGY; PressFit: No; Bonding: No; Part Number: ATM90E26-YU; Component Kind: Standard; Component Type: Standard; Device: ATM90E26-YU; PackageDescription: SOP, 0.65mm Pitch; 28 pin, 5.30mm W X 10.20mm L X 2.00mm H body, IPC Medium Density; Part Description: Single-Phase High-Performance Wide-Span, Energy Metering IC; Manufacturer Part Number: ATM90E26-YU; Pin Count: 28; Case: SSOP28; Mounted: Yes; Socket: No; SMD: Yes; Sense: No; ComponentHeight: 2mm; Author: CERN DEM MR; HelpURL: \\cern.ch\dfs\Applications\Altium\Datasheets\ATM90E26-YU.pdf; CreateDate: 13.12.2017; LatestRevisionDate: 13.12.2017
J1 = PHOENIX_1751248: Terminal Block, 2 Positions, Screw Connection; Part Description: 10A 160V, Terminal Block, Pitch 3.5mm, 2 Positions, Screw Connection; Manufacturer: PHOENIX CONTACT; Manufacturer Part Number: 1751248 (MKDS 1/ 2-3,5); PressFit: No; Part Number: PHOENIX_1751248; Component Kind: Standard; Component Type: Standard; Pin Count: 2; Mounted: Yes; Socket: No; SMD: No; Sense: No; Status: None; ComponentHeight: 8.5mm; HelpURL: \\cern.ch\dfs\Applications\Altium\Datasheets\PHOENIX_1751248.pdf; Author: CERN DEM JLC; CreateDate: 03.11.2009; LatestRevisionDate: 26.04.2010
J2 = PHOENIX_1725656: Terminal Block, 2 Positions, Screw Connection; Part Description: 6A, 63V, Terminal Block, Pitch 2.54mm, 2 Positions, Screw Connection; Manufacturer: PHOENIX CONTACT; Manufacturer Part Number: 1725656 (MPT 0,5/2-2,54); PressFit: No; Part Number: PHOENIX_1725656; Component Kind: Standard; Component Type: Standard; Pin Count: 2; Mounted: Yes; Socket: No; SMD: No; Sense: No; Status: None; ComponentHeight: 8.5mm; HelpURL: \\cern.ch\dfs\Applications\Altium\Datasheets\PHOENIX_1725656.pdf; Author: CERN DEM JMW; CreateDate: 07.11.2008; LatestRevisionDate: 26.04.2010
L1 = IND0402_MURATA_BLM15HB221SN1: Inductor; Part Description: SMD EMIFIL Suppression Chip Ferrite Bead; Manufacturer: MURATA; Power: 250mA; Resistance: 1R; Tolerance: ±25%; Part Number: IND0402_MURATA_BLM15HB221SN1; Component Kind: Standard; Component Type: Standard; Pin Count: 2; Value: 220R@100MHz; Status: None; Manufacturer Part Number: BLM15HB221SN1; Case: 0402; Mounted: Yes; Socket: No; SMD: Yes; Sense: No; ComponentHeight: 0.55mm; HelpURL: \\cern.ch\dfs\Applications\Altium\Datasheets\IND0402_MURATA_BLM15H.pdf; Author: CERN DEM JLC; CreateDate: 23.06.2009; LatestRevisionDate: 23.06.2009
R1 R2 R4 R5 = R1206_470K_1%_0.25W_100PPM: Resistor - 1%; Part Description: General Purpose Thick Film Chip Resistor; Manufacturer: GENERIC; Manufacturer1 Part Number: NRC12F4703TRF; Power: 0.25W; TC: ±100ppm/°C; PressFit: No; Part Number: R1206_470K_1%_0.25W_100PPM; Component Kind: Standard; Component Type: Standard; Pin Count: 2; Value: 470k; Status: Preferred; Tolerance: ±1%; Manufacturer Part Number: R1206_470K_1%_0.25W_100PPM; Case: 1206; Mounted: Yes; Sense: No; Socket: No; SMD: Yes; Manufacturer1 Example: NIC COMPONENT; Manufacturer1 ComponentHeight: 0.65mm; HelpURL: \\cern.ch\dfs\Applications\Altium\Datasheets\R1206_NIC_NRC.pdf; Author: CERN DEM JLC; CreateDate: 03.12.2007; LatestRevisionDate: 13.03.2008
R3 R10 = R0402_100R_1%_0.0625W_100PPM: Resistor - 1%; Part Description: General Purpose Thick Film Chip Resistor; Manufacturer: GENERIC; Manufacturer1 Part Number: 232270671001L; TC: ±100ppm/°C; PressFit: No; Part Number: R0402_100R_1%_0.0625W_100PPM; Component Kind: Standard; Component Type: Standard; Pin Count: 2; Value: 100; Status: Not Recommended; Power: 0.0625W; Tolerance: ±1%; Manufacturer Part Number: R0402_100R_1%_0.0625W_100PPM; Case: 0402; Mounted: Yes; Sense: No; Socket: No; SMD: Yes; Manufacturer1 Example: YAGEO PHYCOMP; Manufacturer1 ComponentHeight: 0.4mm; HelpURL: \\cern.ch\dfs\Applications\Altium\Datasheets\R0402_Phycomp_RC0402.pdf; Author: CERN DEM JLC; CreateDate: 03.12.2007; LatestRevisionDate: 17.10.2012
R6-R8 R12 = R0402_1K_1%_0.0625W_100PPM: as R7 on sheet Power_meter; Part Number: R0402_1K_1%_0.0625W_100PPM; Component Kind: Standard; Component Type: Standard; Pin Count: 2; Value: 1k; Status: Not Recommended; Power: 0.0625W; Tolerance: ±1%; Manufacturer Part Number: R0402_1K_1%_0.0625W_100PPM; Case: 0402; Mounted: Yes; Sense: No; Socket: No; SMD: Yes; Manufacturer1 Example: YAGEO PHYCOMP; Manufacturer1 ComponentHeight: 0.4mm; HelpURL: \\cern.ch\dfs\Applications\Altium\Datasheets\R0402_Phycomp_RC0402.pdf; Author: CERN DEM JLC; CreateDate: 03.12.2007; LatestRevisionDate: 17.10.2012
R9 R11 = R0603_2R4_1%_0.1W_200PPM: Resistor - 1%; Part Description: General Purpose Thick Film Chip Resistor; Manufacturer: GENERIC; Manufacturer1 Part Number: 232270462408L or RC0603FR-072R4L; Power: 0.1W; TC: ±200ppm/°C; PressFit: No; Part Number: R0603_2R4_1%_0.1W_200PPM; Component Kind: Standard; Component Type: Standard; Pin Count: 2; Value: 2R4; Status: Preferred; Tolerance: ±1%; Manufacturer Part Number: R0603_2R4_1%_0.1W_200PPM; Case: 0603; Mounted: Yes; Sense: No; Socket: No; SMD: Yes; Manufacturer1 Example: YAGEO PHYCOMP; Manufacturer1 ComponentHeight: 0.65mm; HelpURL: \\cern.ch\dfs\Applications\Altium\Datasheets\R0603_Tyco_RN73.pdf; Author: CERN DEM JLC; CreateDate: 03.12.2007; LatestRevisionDate: 17.10.2012
R13 R14 = R0402_0R_JUMPER: Resistor; Part Description: 1A (0.05R Max DC Resistance) Zero Ohm Jumper; Manufacturer: GENERIC; Manufacturer1 Part Number: 232270591001L; PressFit: No; Part Number: R0402_0R_JUMPER; Component Kind: Standard; Component Type: Standard; Pin Count: 2; Value: 0; Status: Not Recommended; Manufacturer Part Number: R0402_0R_JUMPER; Case: 0402; Mounted: Yes; Sense: No; Socket: No; SMD: Yes; Manufacturer1 Example: YAGEO PHYCOMP; Manufacturer1 ComponentHeight: 0.4mm; HelpURL: \\cern.ch\dfs\Applications\Altium\Datasheets\R0402_Phycomp_RC0402.pdf; Author: CERN DEM JLC; CreateDate: 03.12.2007; LatestRevisionDate: 17.10.2012
TP1 TP2 = SMD_PAD_1.27X1.27MM: as TP3 on sheet Power_meter; Part Number: SMD_PAD_1.27X1.27MM; Component Kind: Standard (No BOM); Component Type: Standard (No BOM); Pin Count: 1; Family: Test Point; Socket: No; SMD: Yes; Sense: No; Status: None; ComponentHeight: 0mm; HelpURL: Undefined; Author: CERN DEM JLC; CreateDate: 12.01.2008; LatestRevisionDate: 12.01.2008; PackageDescription: 1.27mm x 1.27mm PCB Copper Area (SMD Test Point)

## Nets that join several sheets
GND: Power_meter (27 pins), U_Meas_Channel (21 pins), U_Meas_Channel (21 pins)
P3V3: Power_meter (13 pins), U_Meas_Channel (5 pins), U_Meas_Channel (5 pins)
CLK_8.192: Power_meter (IC4#1.12), U_Meas_Channel (IC1B.22), U_Meas_Channel (IC1A.22)
CS0: Power_meter (IC4#1.32), U_Meas_Channel (IC1B.24)
CS1: Power_meter (IC4#1.19), U_Meas_Channel (IC1A.24)
NetD8_2: Power_meter (D8.2), U_Meas_Channel (IC1B.20)
NetD9_2: Power_meter (D9.2), U_Meas_Channel (IC1A.20)
PM_RESETn: Power_meter (IC4#1.2), U_Meas_Channel (IC1B.4), U_Meas_Channel (IC1A.4)
SCLK: Power_meter (IC4#1.24), U_Meas_Channel (IC1B.25), U_Meas_Channel (IC1A.25)
SI/RX: Power_meter (IC4#1.22), U_Meas_Channel (IC1B.27), U_Meas_Channel (IC1A.27)
SO/TX: Power_meter (IC4#1.23), U_Meas_Channel (IC1B.26), U_Meas_Channel (IC1A.26)

## Assembly variants
SMD_DCDC: not fitted IC46 IC53